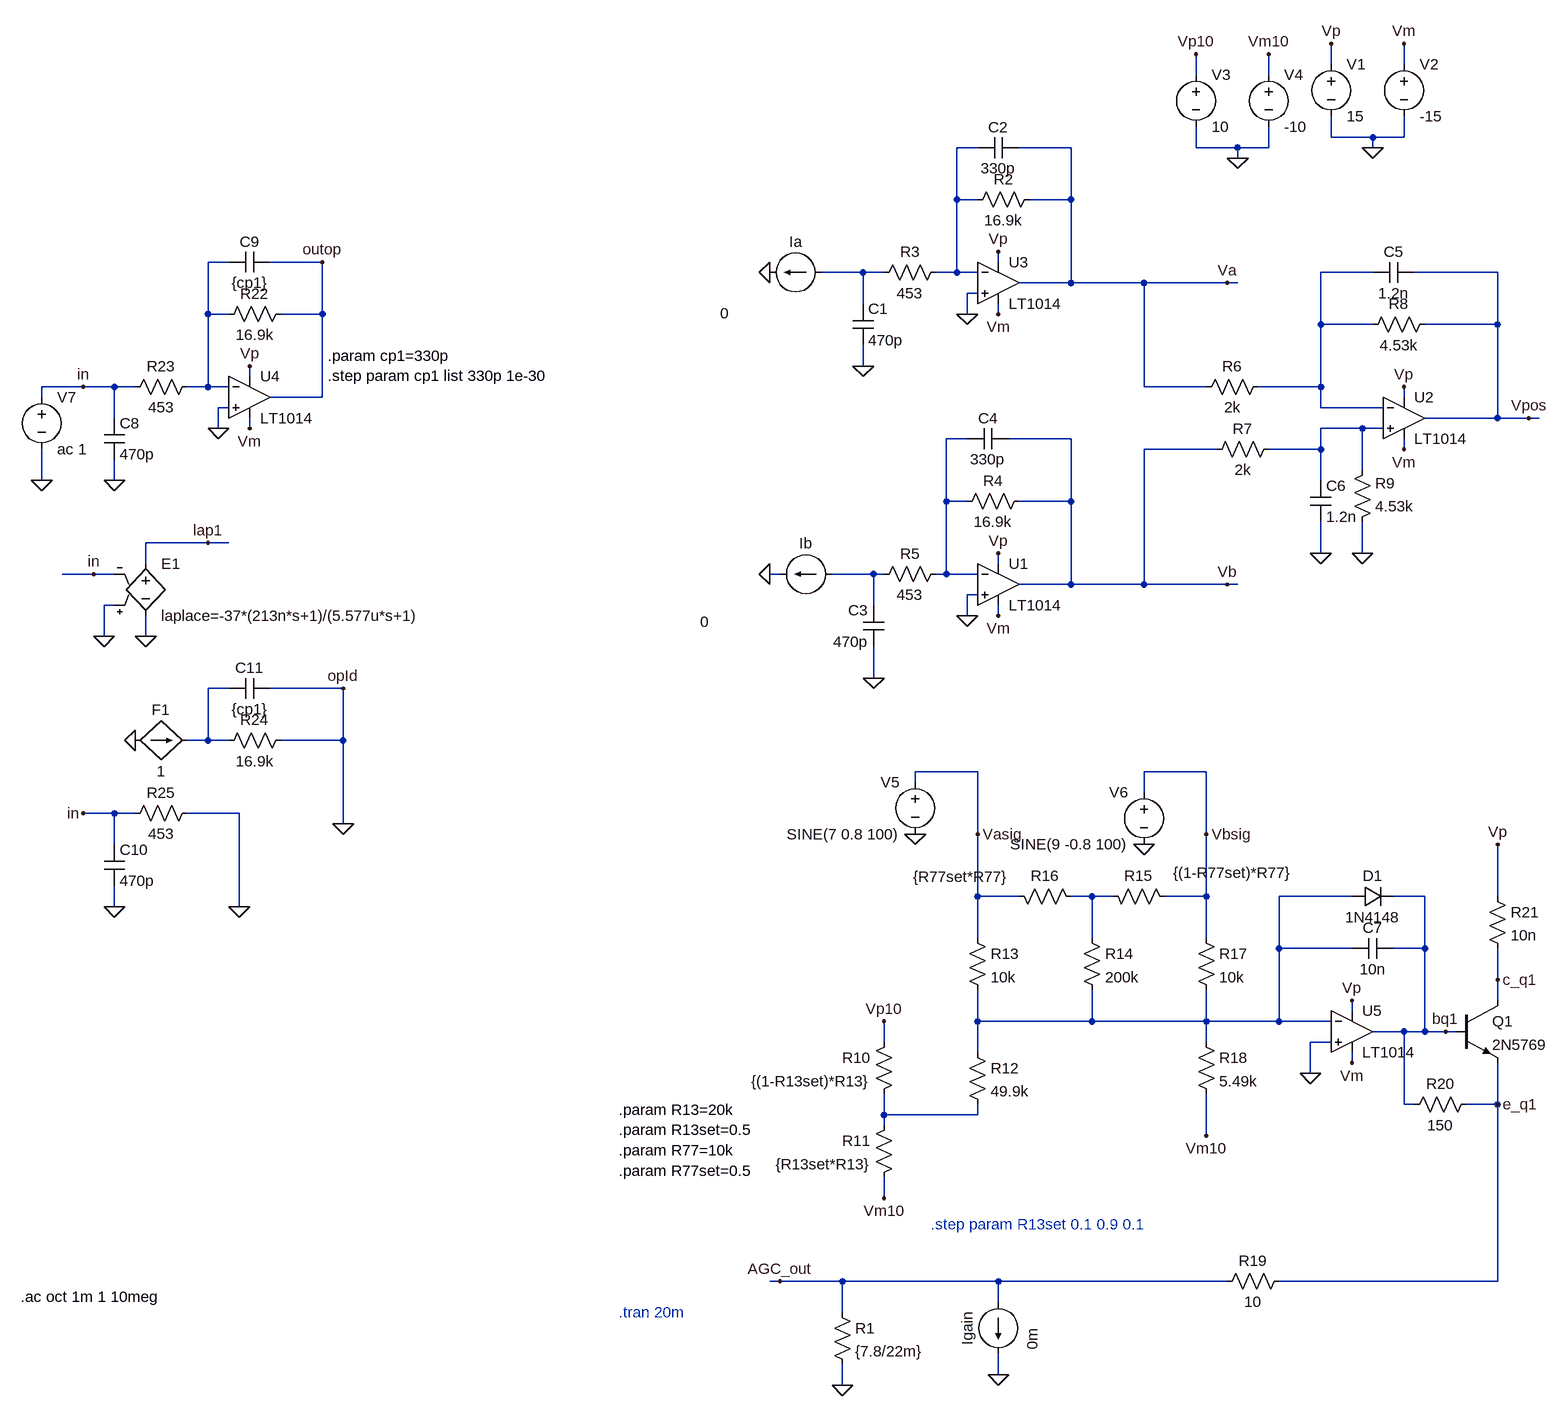
[diagram p0: schematic PositionDemodulator_CamTech.asc]
PositionDemodulator_CamTech.asc, the LTspice schematic file:
Version 4
SHEET 1 2148 1844
WIRE 1072 -208 1072 -240
WIRE 1184 -208 1184 -240
WIRE 864 -192 864 -224
WIRE 976 -192 976 -224
WIRE 1072 -96 1072 -128
WIRE 1136 -96 1072 -96
WIRE 1184 -96 1184 -128
WIRE 1184 -96 1136 -96
WIRE 528 -80 496 -80
WIRE 672 -80 592 -80
WIRE 864 -80 864 -112
WIRE 928 -80 864 -80
WIRE 976 -80 976 -112
WIRE 976 -80 928 -80
WIRE 1136 -80 1136 -96
WIRE 928 -64 928 -80
WIRE 496 0 496 -80
WIRE 528 0 496 0
WIRE 672 0 672 -80
WIRE 672 0 608 0
WIRE -624 96 -656 96
WIRE -480 96 -560 96
WIRE 560 96 560 80
WIRE 352 112 288 112
WIRE 384 112 352 112
WIRE 496 112 496 0
WIRE 496 112 464 112
WIRE 528 112 496 112
WIRE 1136 112 1056 112
WIRE 1328 112 1200 112
WIRE 672 128 672 0
WIRE 672 128 592 128
WIRE 784 128 672 128
WIRE 912 128 784 128
WIRE 928 128 912 128
WIRE 528 144 512 144
WIRE 352 160 352 112
WIRE -656 176 -656 96
WIRE -624 176 -656 176
WIRE -480 176 -480 96
WIRE -480 176 -544 176
WIRE 512 176 512 144
WIRE 560 176 560 160
WIRE 1056 192 1056 112
WIRE 1136 192 1056 192
WIRE 1328 192 1328 112
WIRE 1328 192 1216 192
WIRE 352 256 352 224
WIRE -592 272 -592 256
WIRE -848 288 -912 288
WIRE -800 288 -848 288
WIRE -768 288 -800 288
WIRE -656 288 -656 176
WIRE -656 288 -688 288
WIRE -624 288 -656 288
WIRE 784 288 784 128
WIRE 880 288 784 288
WIRE 1056 288 1056 192
WIRE 1056 288 960 288
WIRE -912 304 -912 288
WIRE -480 304 -480 176
WIRE -480 304 -560 304
WIRE 1184 304 1184 288
WIRE -624 320 -640 320
WIRE 1056 320 1056 288
WIRE 1152 320 1056 320
WIRE -800 336 -800 288
WIRE 1328 336 1328 192
WIRE 1328 336 1216 336
WIRE 1376 336 1328 336
WIRE 1392 336 1376 336
WIRE -640 352 -640 320
WIRE -592 352 -592 336
WIRE 1120 352 1056 352
WIRE 1152 352 1120 352
WIRE 512 368 480 368
WIRE 672 368 576 368
WIRE 896 384 784 384
WIRE 1056 384 1056 352
WIRE 1056 384 976 384
WIRE 1184 384 1184 368
WIRE 1120 416 1120 352
WIRE -912 432 -912 384
WIRE -800 432 -800 400
WIRE 1056 432 1056 384
WIRE 480 464 480 368
WIRE 512 464 480 464
WIRE 672 464 672 368
WIRE 672 464 592 464
WIRE -656 528 -752 528
WIRE -624 528 -656 528
WIRE 1056 544 1056 496
WIRE 1120 544 1120 496
WIRE -752 560 -752 528
WIRE 560 560 560 544
WIRE -832 576 -880 576
WIRE -800 576 -832 576
WIRE 224 576 208 576
WIRE 368 576 304 576
WIRE 384 576 368 576
WIRE 480 576 480 464
WIRE 480 576 464 576
WIRE 528 576 480 576
WIRE 672 592 672 464
WIRE 672 592 592 592
WIRE 784 592 784 384
WIRE 784 592 672 592
WIRE 912 592 784 592
WIRE 928 592 912 592
WIRE 528 608 512 608
WIRE -800 624 -816 624
WIRE 368 624 368 576
WIRE 512 640 512 608
WIRE 560 640 560 624
WIRE -816 672 -816 624
WIRE -752 672 -752 640
WIRE 368 736 368 688
WIRE -624 752 -656 752
WIRE -448 752 -560 752
WIRE -656 832 -656 752
WIRE -656 832 -688 832
WIRE -624 832 -656 832
WIRE -448 832 -448 752
WIRE -448 832 -544 832
WIRE 528 880 432 880
WIRE 880 880 784 880
WIRE 432 896 432 880
WIRE 784 912 784 880
WIRE -800 944 -848 944
WIRE -768 944 -800 944
WIRE -608 944 -688 944
WIRE -448 960 -448 832
WIRE 528 976 528 880
WIRE 880 976 880 880
WIRE -800 992 -800 944
WIRE 528 1072 528 976
WIRE 592 1072 528 1072
WIRE 704 1072 672 1072
WIRE 736 1072 704 1072
WIRE 880 1072 880 976
WIRE 880 1072 816 1072
WIRE 1104 1072 992 1072
WIRE 1216 1072 1168 1072
WIRE 1328 1072 1328 992
WIRE -800 1088 -800 1056
WIRE -608 1088 -608 944
WIRE 528 1136 528 1072
WIRE 704 1136 704 1072
WIRE 880 1136 880 1072
WIRE 992 1152 992 1072
WIRE 1104 1152 992 1152
WIRE 1216 1152 1216 1072
WIRE 1216 1152 1168 1152
WIRE 1328 1200 1328 1152
WIRE 1328 1232 1328 1200
WIRE 1104 1248 1104 1232
WIRE 528 1264 528 1216
WIRE 704 1264 704 1216
WIRE 704 1264 528 1264
WIRE 880 1264 880 1216
WIRE 880 1264 704 1264
WIRE 992 1264 992 1152
WIRE 992 1264 880 1264
WIRE 1072 1264 992 1264
WIRE 1184 1280 1136 1280
WIRE 1216 1280 1216 1152
WIRE 1216 1280 1184 1280
WIRE 1248 1280 1216 1280
WIRE 1264 1280 1248 1280
WIRE 384 1296 384 1264
WIRE 880 1296 880 1264
WIRE 1072 1296 1040 1296
WIRE 528 1312 528 1264
WIRE 1104 1328 1104 1312
WIRE 1040 1344 1040 1296
WIRE 1184 1392 1184 1280
WIRE 1200 1392 1184 1392
WIRE 1328 1392 1328 1328
WIRE 1328 1392 1280 1392
WIRE 384 1408 384 1376
WIRE 528 1408 528 1392
WIRE 528 1408 384 1408
WIRE 384 1424 384 1408
WIRE 880 1440 880 1376
WIRE 384 1536 384 1504
WIRE 224 1664 208 1664
WIRE 320 1664 224 1664
WIRE 560 1664 320 1664
WIRE 912 1664 560 1664
WIRE 1328 1664 1328 1392
WIRE 1328 1664 992 1664
WIRE 560 1696 560 1664
WIRE 320 1712 320 1664
WIRE 560 1808 560 1776
WIRE 320 1824 320 1792
FLAG 208 112 0
FLAG 352 256 0
FLAG 1136 -80 0
FLAG 1184 -240 Vm
FLAG 1072 -240 Vp
FLAG 560 80 Vp
FLAG 560 176 Vm
FLAG 560 544 Vp
FLAG 560 640 Vm
FLAG 1184 288 Vp
FLAG 1184 384 Vm
FLAG 1104 1232 Vp
FLAG 1104 1328 Vm
FLAG 512 176 0
FLAG 512 640 0
FLAG 1120 544 0
FLAG 1056 544 0
FLAG 368 736 0
FLAG 208 576 0
FLAG 912 592 Vb
FLAG 912 128 Va
FLAG 928 -64 0
FLAG 976 -224 Vm10
FLAG 864 -224 Vp10
FLAG 384 1264 Vp10
FLAG 384 1536 Vm10
FLAG 880 1440 Vm10
FLAG 1328 992 Vp
FLAG 1040 1344 0
FLAG 528 976 Vasig
FLAG 880 976 Vbsig
FLAG 224 1664 AGC_out
FLAG 1376 336 Vpos
FLAG 320 1824 0
FLAG 560 1808 0
FLAG 784 992 0
FLAG 432 976 0
FLAG 1248 1280 bq1
FLAG 1328 1200 c_q1
FLAG 1328 1392 e_q1
FLAG -912 432 0
FLAG -800 432 0
FLAG -592 256 Vp
FLAG -592 352 Vm
FLAG -640 352 0
FLAG -848 288 in
FLAG -752 672 0
FLAG -816 672 0
FLAG -656 528 lap1
FLAG -832 576 in
FLAG -480 96 outop
FLAG -800 1088 0
FLAG -848 944 in
FLAG -448 752 opId
FLAG -608 1088 0
FLAG -768 832 0
FLAG -448 960 0
SYMBOL current 288 112 R90
WINDOW 0 -32 40 VBottom 2
WINDOW 3 47 149 VTop 2
WINDOW 123 0 0 Left 2
WINDOW 39 0 0 Left 2
SYMATTR InstName Ia
SYMATTR Value 0
SYMBOL current 304 576 R90
WINDOW 0 -32 40 VBottom 2
WINDOW 3 58 196 VTop 2
WINDOW 123 0 0 Left 2
WINDOW 39 0 0 Left 2
SYMATTR InstName Ib
SYMATTR Value 0
SYMBOL cap 336 160 R0
SYMATTR InstName C1
SYMATTR Value 470p
SYMBOL res 624 -16 R90
WINDOW 0 0 56 VBottom 2
WINDOW 3 32 56 VTop 2
SYMATTR InstName R2
SYMATTR Value 16.9k
SYMBOL res 480 96 R90
WINDOW 0 0 56 VBottom 2
WINDOW 3 32 56 VTop 2
SYMATTR InstName R3
SYMATTR Value 453
SYMBOL res 608 448 R90
WINDOW 0 0 56 VBottom 2
WINDOW 3 32 56 VTop 2
SYMATTR InstName R4
SYMATTR Value 16.9k
SYMBOL res 480 560 R90
WINDOW 0 0 56 VBottom 2
WINDOW 3 32 56 VTop 2
SYMATTR InstName R5
SYMATTR Value 453
SYMBOL res 976 272 R90
WINDOW 0 0 56 VBottom 2
WINDOW 3 32 56 VTop 2
SYMATTR InstName R6
SYMATTR Value 2k
SYMBOL res 992 368 R90
WINDOW 0 0 56 VBottom 2
WINDOW 3 32 56 VTop 2
SYMATTR InstName R7
SYMATTR Value 2k
SYMBOL res 1232 176 R90
WINDOW 0 0 56 VBottom 2
WINDOW 3 32 56 VTop 2
SYMATTR InstName R8
SYMATTR Value 4.53k
SYMBOL res 1104 512 M180
WINDOW 0 36 76 Left 2
WINDOW 3 36 40 Left 2
SYMATTR InstName R9
SYMATTR Value 4.53k
SYMBOL cap 592 -96 R90
WINDOW 0 0 32 VBottom 2
WINDOW 3 32 32 VTop 2
SYMATTR InstName C2
SYMATTR Value 330p
SYMBOL cap 384 688 R180
WINDOW 0 24 56 Left 2
WINDOW 3 24 8 Left 2
SYMATTR InstName C3
SYMATTR Value 470p
SYMBOL cap 512 384 R270
WINDOW 0 32 32 VTop 2
WINDOW 3 0 32 VBottom 2
SYMATTR InstName C4
SYMATTR Value 330p
SYMBOL cap 1136 128 R270
WINDOW 0 32 32 VTop 2
WINDOW 3 0 32 VBottom 2
SYMATTR InstName C5
SYMATTR Value 1.2n
SYMBOL cap 1040 432 R0
SYMATTR InstName C6
SYMATTR Value 1.2n
SYMBOL cap 1168 1136 R90
WINDOW 0 0 32 VBottom 2
WINDOW 3 32 32 VTop 2
SYMATTR InstName C7
SYMATTR Value 10n
SYMBOL Opamps\\LT1014 560 64 R0
SYMATTR InstName U3
SYMBOL voltage 1072 -224 R0
WINDOW 123 0 0 Left 2
WINDOW 39 0 0 Left 2
SYMATTR InstName V1
SYMATTR Value 15
SYMBOL voltage 1184 -224 R0
WINDOW 123 0 0 Left 2
WINDOW 39 0 0 Left 2
SYMATTR InstName V2
SYMATTR Value -15
SYMBOL Opamps\\LT1014 560 528 R0
SYMATTR InstName U1
SYMBOL Opamps\\LT1014 1184 272 R0
SYMATTR InstName U2
SYMBOL Opamps\\LT1014 1104 1216 R0
SYMATTR InstName U5
SYMBOL res 400 1280 M0
SYMATTR InstName R10
SYMATTR Value {(1-R13set)*R13}
SYMBOL res 400 1408 M0
SYMATTR InstName R11
SYMATTR Value {R13set*R13}
SYMBOL res 512 1296 R0
SYMATTR InstName R12
SYMATTR Value 49.9k
SYMBOL res 512 1120 R0
SYMATTR InstName R13
SYMATTR Value 10k
SYMBOL res 688 1120 R0
SYMATTR InstName R14
SYMATTR Value 200k
SYMBOL res 832 1088 M270
WINDOW 0 32 56 VTop 2
WINDOW 3 68 -89 VBottom 2
SYMATTR InstName R15
SYMATTR Value {(1-R77set)*R77}
SYMBOL res 688 1088 M270
WINDOW 0 32 56 VTop 2
WINDOW 3 62 186 VBottom 2
SYMATTR InstName R16
SYMATTR Value {R77set*R77}
SYMBOL res 864 1120 R0
SYMATTR InstName R17
SYMATTR Value 10k
SYMBOL res 864 1280 R0
SYMATTR InstName R18
SYMATTR Value 5.49k
SYMBOL diode 1104 1088 R270
WINDOW 0 32 32 VTop 2
WINDOW 3 0 32 VBottom 2
SYMATTR InstName D1
SYMATTR Value 1N4148
SYMBOL npn 1264 1232 R0
SYMATTR InstName Q1
SYMATTR Value 2N5769
SYMBOL res 1008 1648 R90
WINDOW 0 0 56 VBottom 2
WINDOW 3 32 56 VTop 2
SYMATTR InstName R19
SYMATTR Value 10
SYMBOL voltage 864 -208 R0
WINDOW 123 0 0 Left 2
WINDOW 39 0 0 Left 2
SYMATTR InstName V3
SYMATTR Value 10
SYMBOL voltage 976 -208 R0
WINDOW 123 0 0 Left 2
WINDOW 39 0 0 Left 2
SYMATTR InstName V4
SYMATTR Value -10
SYMBOL res 1184 1408 R270
WINDOW 0 32 56 VTop 2
WINDOW 3 0 56 VBottom 2
SYMATTR InstName R20
SYMATTR Value 150
SYMBOL res 304 1696 R0
SYMATTR InstName R1
SYMATTR Value {7.8/22m}
SYMBOL current 560 1696 R0
WINDOW 0 -32 40 VBottom 2
WINDOW 3 37 57 VTop 2
WINDOW 123 0 0 Left 2
WINDOW 39 0 0 Left 2
SYMATTR InstName Igain
SYMATTR Value 0m
SYMBOL res 1312 1056 R0
SYMATTR InstName R21
SYMATTR Value 10n
SYMBOL voltage 432 880 M0
WINDOW 123 0 0 Left 2
WINDOW 39 0 0 Left 2
SYMATTR InstName V5
SYMATTR Value SINE(7 0.8 100)
SYMBOL voltage 784 896 M0
WINDOW 123 0 0 Left 2
WINDOW 39 0 0 Left 2
SYMATTR InstName V6
SYMATTR Value SINE(9 -0.8 100)
SYMBOL cap -816 336 R0
SYMATTR InstName C8
SYMATTR Value 470p
SYMBOL res -528 160 R90
WINDOW 0 0 56 VBottom 2
WINDOW 3 32 56 VTop 2
SYMATTR InstName R22
SYMATTR Value 16.9k
SYMBOL res -672 272 R90
WINDOW 0 0 56 VBottom 2
WINDOW 3 32 56 VTop 2
SYMATTR InstName R23
SYMATTR Value 453
SYMBOL Opamps\\LT1014 -592 240 R0
SYMATTR InstName U4
SYMBOL cap -560 80 R90
WINDOW 0 0 32 VBottom 2
WINDOW 3 32 32 VTop 2
SYMATTR InstName C9
SYMATTR Value {cp1}
SYMBOL voltage -912 288 R0
WINDOW 123 0 0 Left 2
WINDOW 39 0 0 Left 2
SYMATTR InstName V7
SYMATTR Value ac 1
SYMBOL e2 -752 544 R0
SYMATTR InstName E1
SYMATTR Value laplace=-37*(213n*s+1)/(5.577u*s+1)
SYMBOL cap -816 992 R0
SYMATTR InstName C10
SYMATTR Value 470p
SYMBOL res -528 816 R90
WINDOW 0 0 56 VBottom 2
WINDOW 3 32 56 VTop 2
SYMATTR InstName R24
SYMATTR Value 16.9k
SYMBOL res -672 928 R90
WINDOW 0 0 56 VBottom 2
WINDOW 3 32 56 VTop 2
SYMATTR InstName R25
SYMATTR Value 453
SYMBOL cap -560 736 R90
WINDOW 0 0 32 VBottom 2
WINDOW 3 32 32 VTop 2
SYMATTR InstName C11
SYMATTR Value {cp1}
SYMBOL f -768 832 R270
WINDOW 0 32 40 VTop 2
WINDOW 3 -32 40 VBottom 2
SYMATTR InstName F1
SYMATTR Value 1
TEXT -24 1400 Left 2 !.param R13=20k\n.param R13set=0.5\n.param R77=10k\n.param R77set=0.5
TEXT -24 1712 Left 2 ;.tran 20m
TEXT 456 1576 Left 2 ;.step param R13set 0.1 0.9 0.1
TEXT -944 1688 Left 2 !.ac oct 1m 1 10meg
TEXT -472 240 Left 2 !.param cp1=330p\n.step param cp1 list 330p 1e-30

The netlist it stands for:
* PositionDemodulator_CamTech.asc
Ia N003 0 0
Ib N007 0 0
C1 N003 0 470p
R2 Va N001 16.9k
R3 N001 N003 453
R4 Vb N006 16.9k
R5 N006 N007 453
R6 N004 Va 2k
R7 N005 Vb 2k
R8 Vpos N004 4.53k
R9 0 N005 4.53k
C2 Va N001 330p
C3 0 N007 470p
C4 N006 Vb 330p
C5 N004 Vpos 1.2n
C6 N005 0 1.2n
C7 bq1 N010 10n
XU3 0 N001 Vp Vm Va LT1014  ; pins In+ In- V+ V- OUT
V1 Vp 0 15
V2 Vm 0 -15
XU1 0 N006 Vp Vm Vb LT1014  ; pins In+ In- V+ V- OUT
XU2 N005 N004 Vp Vm Vpos LT1014  ; pins In+ In- V+ V- OUT
XU5 0 N010 Vp Vm bq1 LT1014  ; pins In+ In- V+ V- OUT
R10 Vp10 N011 {(1-R13set)*R13}
R11 N011 Vm10 {R13set*R13}
R12 N010 N011 49.9k
R13 Vasig N010 10k
R14 N009 N010 200k
R15 Vbsig N009 {(1-R77set)*R77}
R16 N009 Vasig {R77set*R77}
R17 Vbsig N010 10k
R18 N010 Vm10 5.49k
D1 N010 bq1 1N4148
Q1 c_q1 bq1 e_q1 0 2N5769
R19 e_q1 AGC_out 10
V3 Vp10 0 10
V4 Vm10 0 -10
R20 bq1 e_q1 150
R1 AGC_out 0 {7.8/22m}
Igain AGC_out 0 0m
R21 Vp c_q1 10n
V5 Vasig 0 SINE(7 0.8 100)
V6 Vbsig 0 SINE(9 -0.8 100)
C8 in 0 470p
R22 outop N002 16.9k
R23 N002 in 453
XU4 0 N002 Vp Vm outop LT1014  ; pins In+ In- V+ V- OUT
C9 outop N002 {cp1}
V7 in 0 ac 1
E1 lap1 0 0 in laplace=-37*(213n*s+1)/(5.577u*s+1)
C10 in 0 470p
R24 0 N008 16.9k
R25 0 in 453
C11 0 N008 {cp1}
F1 0 N008 1
.model D D
.lib standard.dio
.model NPN NPN
.model PNP PNP
.lib standard.bjt
.param R13=20k
.param R13set=0.5
.param R77=10k
.param R77set=0.5
* .tran 20m
* .step param R13set 0.1 0.9 0.1
.ac oct 1m 1 10meg
.param cp1=330p
.step param cp1 list 330p 1e-30
.backanno
.end